# EAGLE design despertador (EAGLE 9.6.2)
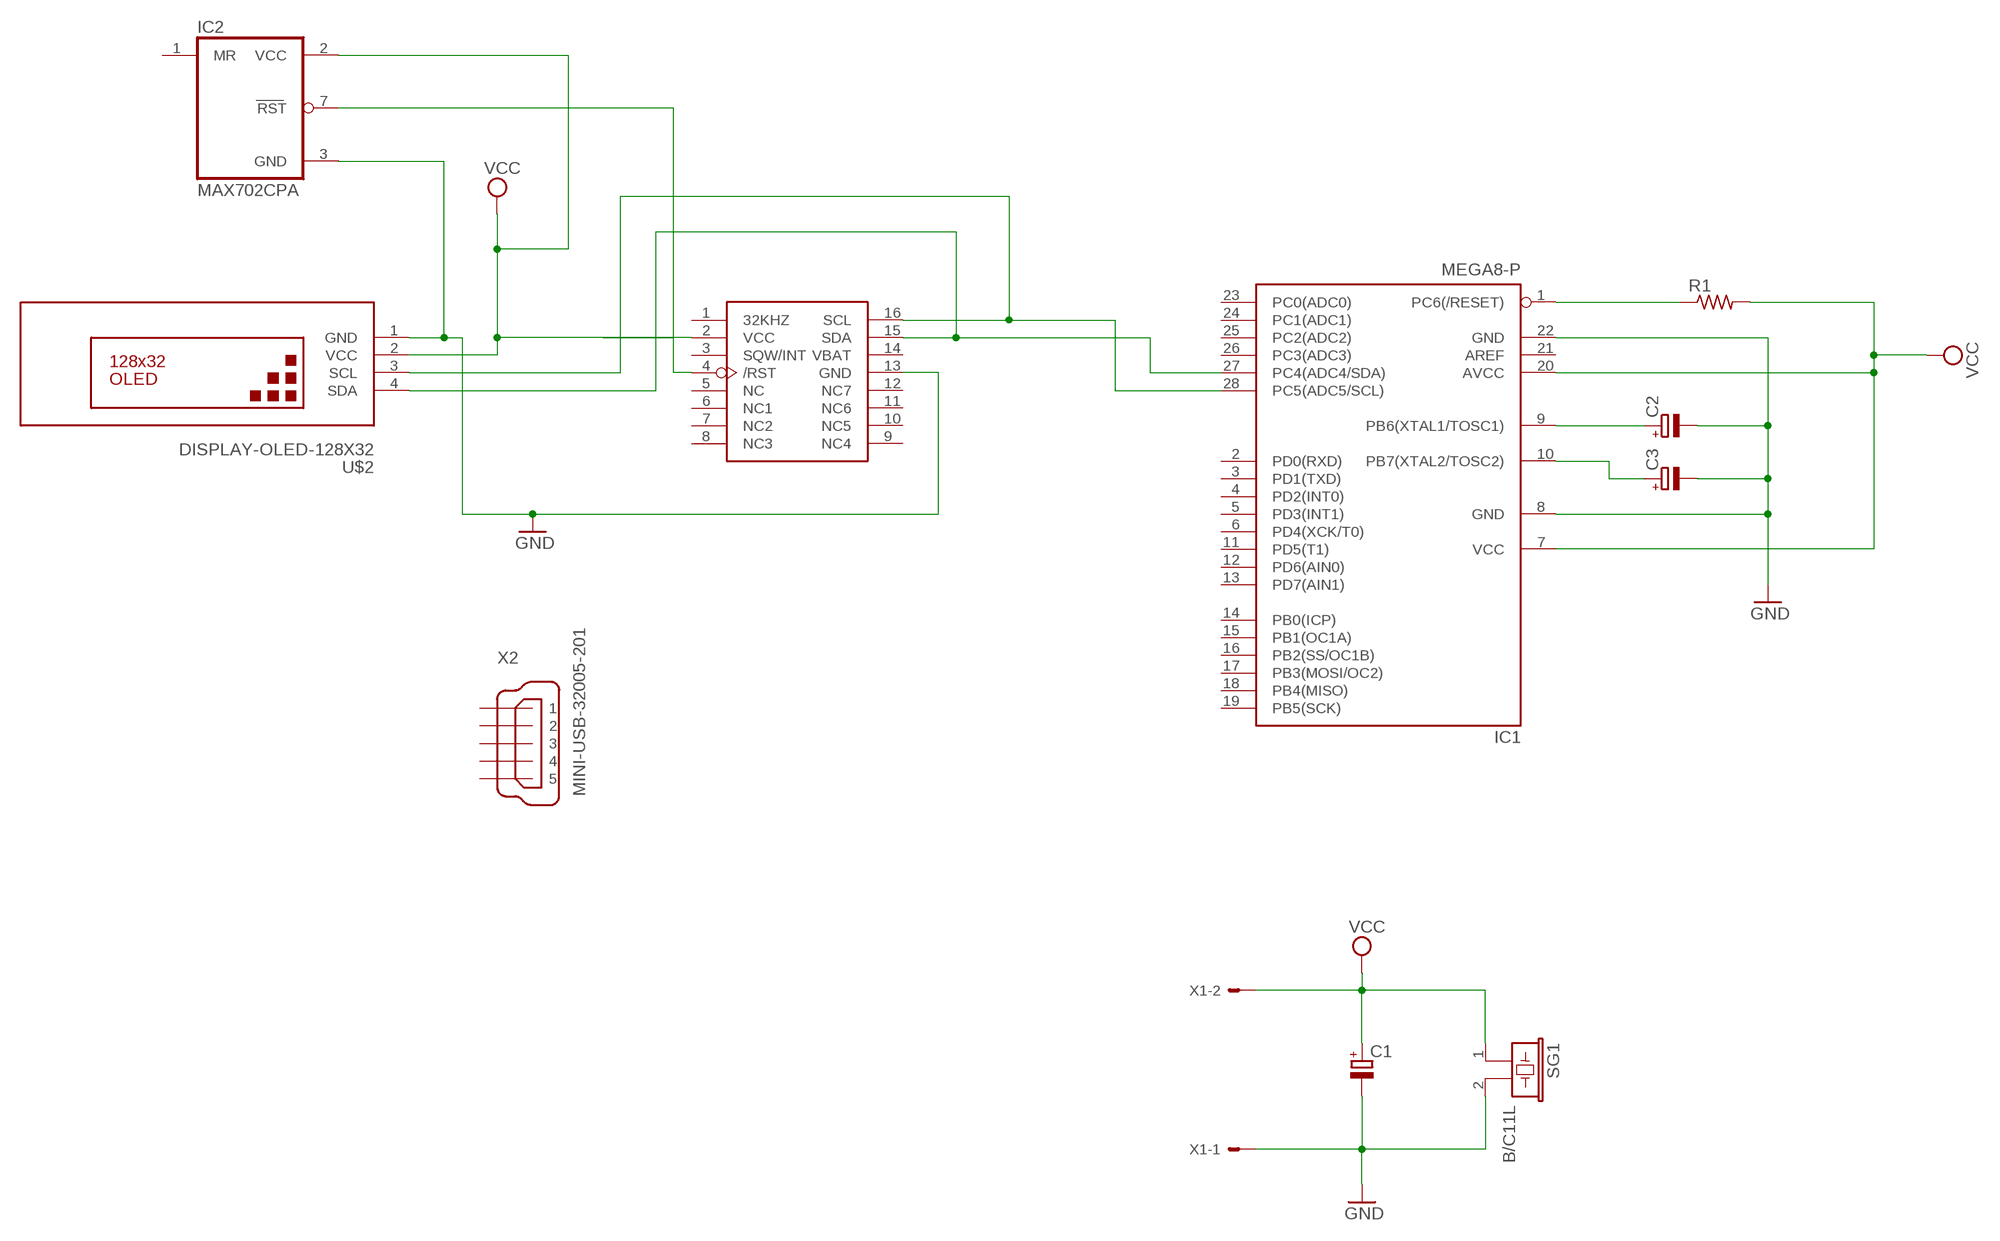
[diagram p0: schematic, sheet 1]

## Parts
C1  CPOL-EUE2.5-6  [E2,5-6]
C2  CPOL-EUE2.5-6  [E2,5-6]
C3  CPOL-EUE2.5-6  [E2,5-6]
IC1  MEGA8-P  [DIL28-3]
IC2  MAX702CPA  [DIL08]
R1  R-US_0207/10  [0207/10]
SG1  B/C11L  [B/C11L]
U$2  DISPLAY-OLED-128X32  [DISPLAY-OLED-128X32]
U$3  DS3231  [PDIP]
X1  KK-156-2  [KK-156-2]
X2  MINI-USB-32005-201  [32005-201]

## Nets
GND: C1.- C2.- C3.- IC1.8(GND) IC1.22(GND) IC2.3(GND) SG1.2 U$2.1(GND) U$3.13(GND) X1.1
N$1: IC1.27(PC4(ADC4/SDA)) U$2.4(SDA) U$3.15(SDA)
N$2: C2.+ IC1.9(PB6(XTAL1/TOSC1))
N$3: C3.+ IC1.10(PB7(XTAL2/TOSC2))
N$4: IC1.1(PC6(/RESET)) R1.1
N$5: IC1.28(PC5(ADC5/SCL)) U$2.3(SCL) U$3.16(SCL)
N$6: IC2.7(RST) U$3.4(/RST)
VCC: C1.+ IC1.7(VCC) IC1.20(AVCC) IC2.2(VCC) R1.2 SG1.1 U$2.2(VCC) U$3.2(VCC) X1.2
Unconnected: IC1.2(PD0(RXD)) IC1.3(PD1(TXD)) IC1.4(PD2(INT0)) IC1.5(PD3(INT1)) IC1.6(PD4(XCK/T0)) IC1.11(PD5(T1)) IC1.12(PD6(AIN0)) IC1.13(PD7(AIN1)) IC1.14(PB0(ICP)) IC1.15(PB1(OC1A)) IC1.16(PB2(SS/OC1B)) IC1.17(PB3(MOSI/OC2)) IC1.18(PB4(MISO)) IC1.19(PB5(SCK)) IC1.21(AREF) IC1.23(PC0(ADC0)) IC1.24(PC1(ADC1)) IC1.25(PC2(ADC2)) IC1.26(PC3(ADC3)) IC2.1(MR) U$3.1(32KHZ) U$3.3(SQW/INT) U$3.5(NC) U$3.6(NC1) U$3.7(NC2) U$3.8(NC3) U$3.9(NC4) U$3.10(NC5) U$3.11(NC6) U$3.12(NC7) U$3.14(VBAT) X2.1 X2.2 X2.3 X2.4 X2.5

## Library data of the parts
C1-C3 = rcl:CPOL-EU: POLARIZED CAPACITOR, European symbol; SPICEPREFIX: C
IC1 = atmel:MEGA8-P: MICROCONTROLLER 8 Kbytes FLASH, 1 kbytes SRAM, 512 bytes EEPROM, USART, 4-channel 10 bit ADC, 2-channel 8 bit ADC Pin compatible with Atmega48, ATMega88, ATMega168 Source: avr.lbr; OC_FARNELL: unknown; OC_NEWARK: unknown
IC2 = maxim:MAX702CPA: POWER SUPPLY MONITOR; MF: MAXIM; MPN: MAX702CPA+; OC_FARNELL: 1188018; OC_NEWARK: 69K6744
R1 = rcl:R-US_: RESISTOR, American symbol; SPICEPREFIX: R
SG1 = buzzer:B/C11L: BUZZER Source: Buerklin; OC_FARNELL: unknown; OC_NEWARK: unknown
U$2 = diy-modules:DISPLAY-OLED-128X32: 128x32 Dot Matrix OLED Module with I2C interface based on SSD1306 chip More details available here: http://www.tinyosshop.com/index.php?route=product/product&product_id=953 Schematic available here: http://www.tinyosshop.com/datasheet/OLED%2012832.pdf SSD1306 datasheet: https://cdn-shop.adafruit.com/datasheets/SSD1306.pdf Click here to find device on ebay.com <http://www.ebay.com/sch/oled+display+128x32+i2c>
U$3 = Microcontroladores:DS3231: Extremely Accurate I2C-IntegratedRTC/TCXO/Crystal \\// General Description -> The DS3231 is a low-cost, extremely accurate I2C real-time clock (RTC) with an integrated temperature-compensated crystal oscillator (TCXO) and crystal. The device incorporates a battery input, and maintains accurate timekeeping when main power to the device is interrupted. The integration of the crystal resonator enhances the long-term accuracy of the device as well as reduces the piece-part count in a manufacturing line. The DS3231 is available in commercial and industrial temperature ranges, and is offered in a 16-pin, 300-mil SO package.
X1 = con-molex:KK-156-2: KK 156 HEADER Source: http://www.molex.com/pdm_docs/sd/026604100_sd.pdf; MF: MOLEX; OC_FARNELL: unknown; OC_NEWARK: unknown
X2 = con-cypressindustries:MINI-USB-: MINI USB-B Conector Source: www.cypressindustries.com; OC_FARNELL: unknown; OC_NEWARK: unknown

## Board
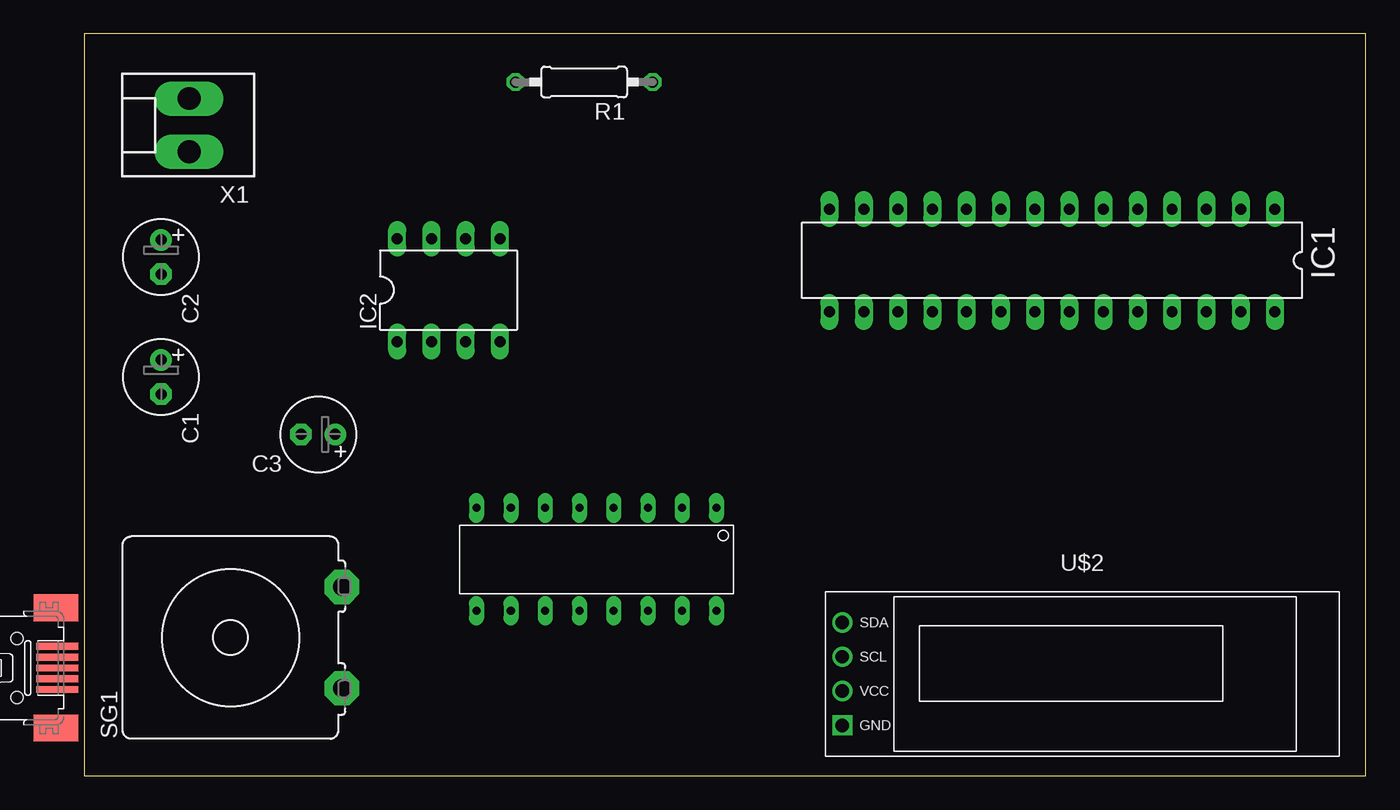
[diagram p1: board, top side]
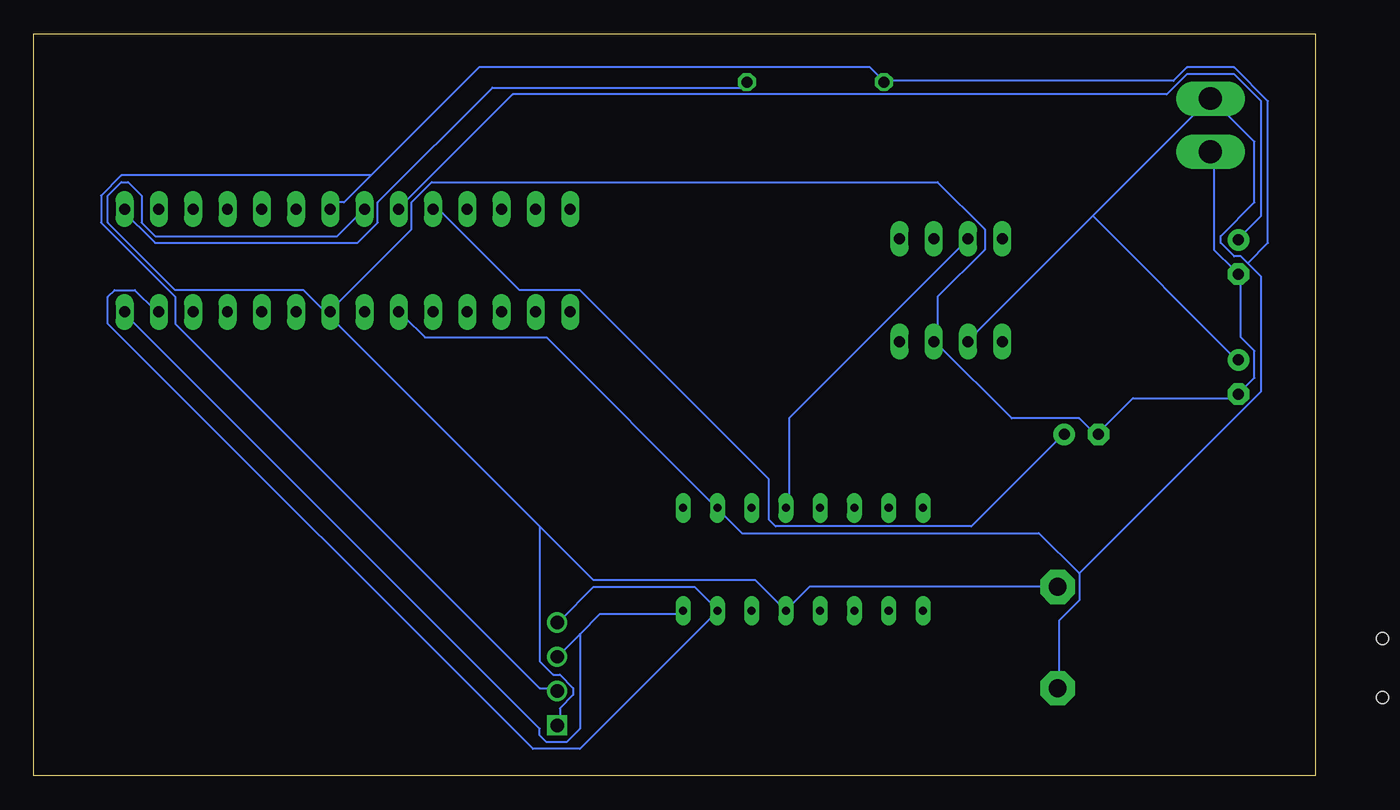
[diagram p2: board, bottom side, seen from below]

Size 95 x 55 mm. Coordinates in mm from the lower left corner, seen from the top.
Outline: 0,0 95,0 95,55 0,55 0,0
Copper layers (1*16): Top 0.035mm / dielectric 1.5mm / Bottom 0.035mm
Design rules "default": minimum track width 6mil, minimum drill 0.35mm, track to track 6mil, track to pad 6mil, pad to pad 6mil, via to via 6mil, smd to smd 6mil, copper to edge 40mil, drill to drill 6mil, minimum pad ring 10mil, minimum via ring 8mil, stop-mask expansion 4mil, vias tented up to drill 0mil, thermal gap 10mil

### Footprints (pad centres in the part's own frame; a part is rotated, then mirrored left to right if it is on the bottom)
E2,5-6 = drill 0.813 pad 1.6: + -1.27,0 | drill 0.813 pad 1.6 octagon: - 1.27,0
DIL28-3 = drill 0.813 long: 1 -16.51,-3.81; 2 -13.97,-3.81; 3 -11.43,-3.81; 4 -8.89,-3.81; 5 -6.35,-3.81; 6 -3.81,-3.81; 7 -1.27,-3.81; 8 1.27,-3.81; 9 3.81,-3.81; 10 6.35,-3.81; 11 8.89,-3.81; 12 11.43,-3.81; 13 13.97,-3.81; 14 16.51,-3.81; 15 16.51,3.81; 16 13.97,3.81; 17 11.43,3.81; 18 8.89,3.81; 19 6.35,3.81; 20 3.81,3.81; 21 1.27,3.81; 22 -1.27,3.81; 23 -3.81,3.81; 24 -6.35,3.81; 25 -8.89,3.81; 26 -11.43,3.81; 27 -13.97,3.81; 28 -16.51,3.81
DIL08 = drill 0.813 long: 1 -3.81,-3.81; 2 -1.27,-3.81; 3 1.27,-3.81; 4 3.81,-3.81; 5 3.81,3.81; 6 1.27,3.81; 7 -1.27,3.81; 8 -3.81,3.81
0207/10 = drill 0.813 octagon: 1 -5.08,0; 2 5.08,0
B/C11L = drill 1.321 pad 2.54 octagon: 1 -3.759,-8.255; 2 3.759,-8.255
DISPLAY-OLED-128X32 = drill 1 square: 1 -17.78,-3.81 | drill 1: 2 -17.78,-1.27; 3 -17.78,1.27; 4 -17.78,3.81
PDIP = drill 0.6 long: 1 -3.81,8.89; 2 -3.81,6.35; 3 -3.81,3.81; 4 -3.81,1.27; 5 -3.81,-1.27; 6 -3.81,-3.81; 7 -3.81,-6.35; 8 -3.81,-8.89; 9 3.81,-8.89; 10 3.81,-6.35; 11 3.81,-3.81; 12 3.81,-1.27; 13 3.81,1.27; 14 3.81,3.81; 15 3.81,6.35; 16 3.81,8.89
KK-156-2 = drill 1.7 pad 2.184 long: 1 -1.98,0; 2 1.98,0
32005-201 = smd 3.1 x 0.5: 1 3,1.6; 2 3,0.8; 3 3,0; 4 3,-0.8; 5 3,-1.6 | smd 2.5 x 2: M1 -3,-4.45; M2 -3,4.45 | smd 3.3 x 2: M3 2.9,4.45; M4 2.9,-4.45 | hole 0.9: 0,2.2; 0,-2.2

### Placement (x,y rotation side)
C1  5.69,29.56 270 top
C2  5.69,38.45 270 top
C3  17.34,25.31 180 top
IC1  71.75,38.2 180 top
IC2  27,36 0 top
R1  37.05,51.42 180 top
SG1  10.84,10.25 90 top
U$2  73.98,7.56 0 top
U$3  37.97,16.05 270 top
X1  7.77,48.22 90 top
X2  -5,8 0 top

### Tracks (layer width: path | path; a pad name or v marks a point on that pad's centre or on a via)
GND
  Bottom 0.152: X1.1 7.5,46 7.5,39 6,37.5 C2.- 5.5,37 5.5,32.5 4.5,31.5 4.5,29.5 5.5,28.5 C1.- 6,28 13.5,28 16,25.5 C3.- 16.5,25.5 17.5,26.5 22.5,26.5 28,32 IC2.3 28,32.5 28,35.5 24.5,39 24.5,40.5 28,44 65.5,44 67,42.5 67,40.5 73,34.5 IC1.22 | SG1.2 19.5,14 37.5,14 39,12.5 U$3.13 41.5,14.5 53.5,14.5 57.5,18.5 | 57.5,18.5 73,34 IC1.22 | IC1.8 70.5,42 72.5,40 86,40 87,41 87,43 88,44 88.5,44 89.5,43 89.5,41 84.5,36 75,36 73.5,34.5 IC1.22 | 57.5,18.5 57.5,8.5 56.5,7.5 56,7.5 55,6.5 55,6 56,5 56,4 U$2.1
N$1
  Bottom 0.152: U$2.4 56,11.5 53.5,14 46,14 44.5,12.5 U$3.15 44.5,12 54.5,2 58,2 89.5,33.5 89.5,35.5 89,36 87.5,36 86,34.5 IC1.27
N$2
  Bottom 0.152: C2.+ 5.5,40 4,41.5 4,50 6,52 9.5,52 11,50.5 59.5,50.5 67.5,42.5 IC1.9
N$3
  Bottom 0.152: IC1.10 65,42 59,36 54.5,36 40.5,22 40.5,19 40,18.5 25.5,18.5 19,25 C3.+
N$4
  Bottom 0.152: R1.1 42.5,51 61,51 69.5,42.5 69.5,41 71,39.5 86,39.5 88.5,42 IC1.1
N$5
  Bottom 0.152: 54.5,10.5 56,9 U$2.3 | 54.5,10.5 53,12 47,12 U$3.16 | 54.5,10.5 54.5,3.5 55.5,2.5 57,2.5 57.5,3 57.5,3.5 88,34 IC1.28
N$6
  Bottom 0.152: U$3.4 39,20 39,26.5 26,39.5 IC2.7
VCC
  Bottom 0.152: 70,44.5 62,52.5 33,52.5 32,51.5 R1.2 31.5,51.5 10.5,51.5 9.5,52.5 6,52.5 3.5,50 3.5,39.5 5,38 | 70,44.5 72,42.5 73,42.5 IC1.7 | 70,44.5 88.5,44.5 90,43 90,41 84.5,35.5 84.5,33.5 57.5,6.5 56.5,6.5 U$2.2 | 16.5,41.5 8,50 X1.2 7.5,50 4.5,47 4.5,42.5 7,40 7,39.5 6,38.5 5.5,38.5 5,38 | 16.5,41.5 25.5,32.5 IC2.2 | 16.5,41.5 6,31 C1.+ | IC1.20 67.5,34 66,32.5 57,32.5 44.5,20 U$3.2 44,19.5 42.5,18 20.5,18 17.5,15 | 17.5,15 17.5,13 19,11.5 19,6.5 SG1.1 | 5,38 4,37 4,28.5 17.5,15